# EAGLE schematic Rocekt_test_stand_input (EAGLE 9.2.0)
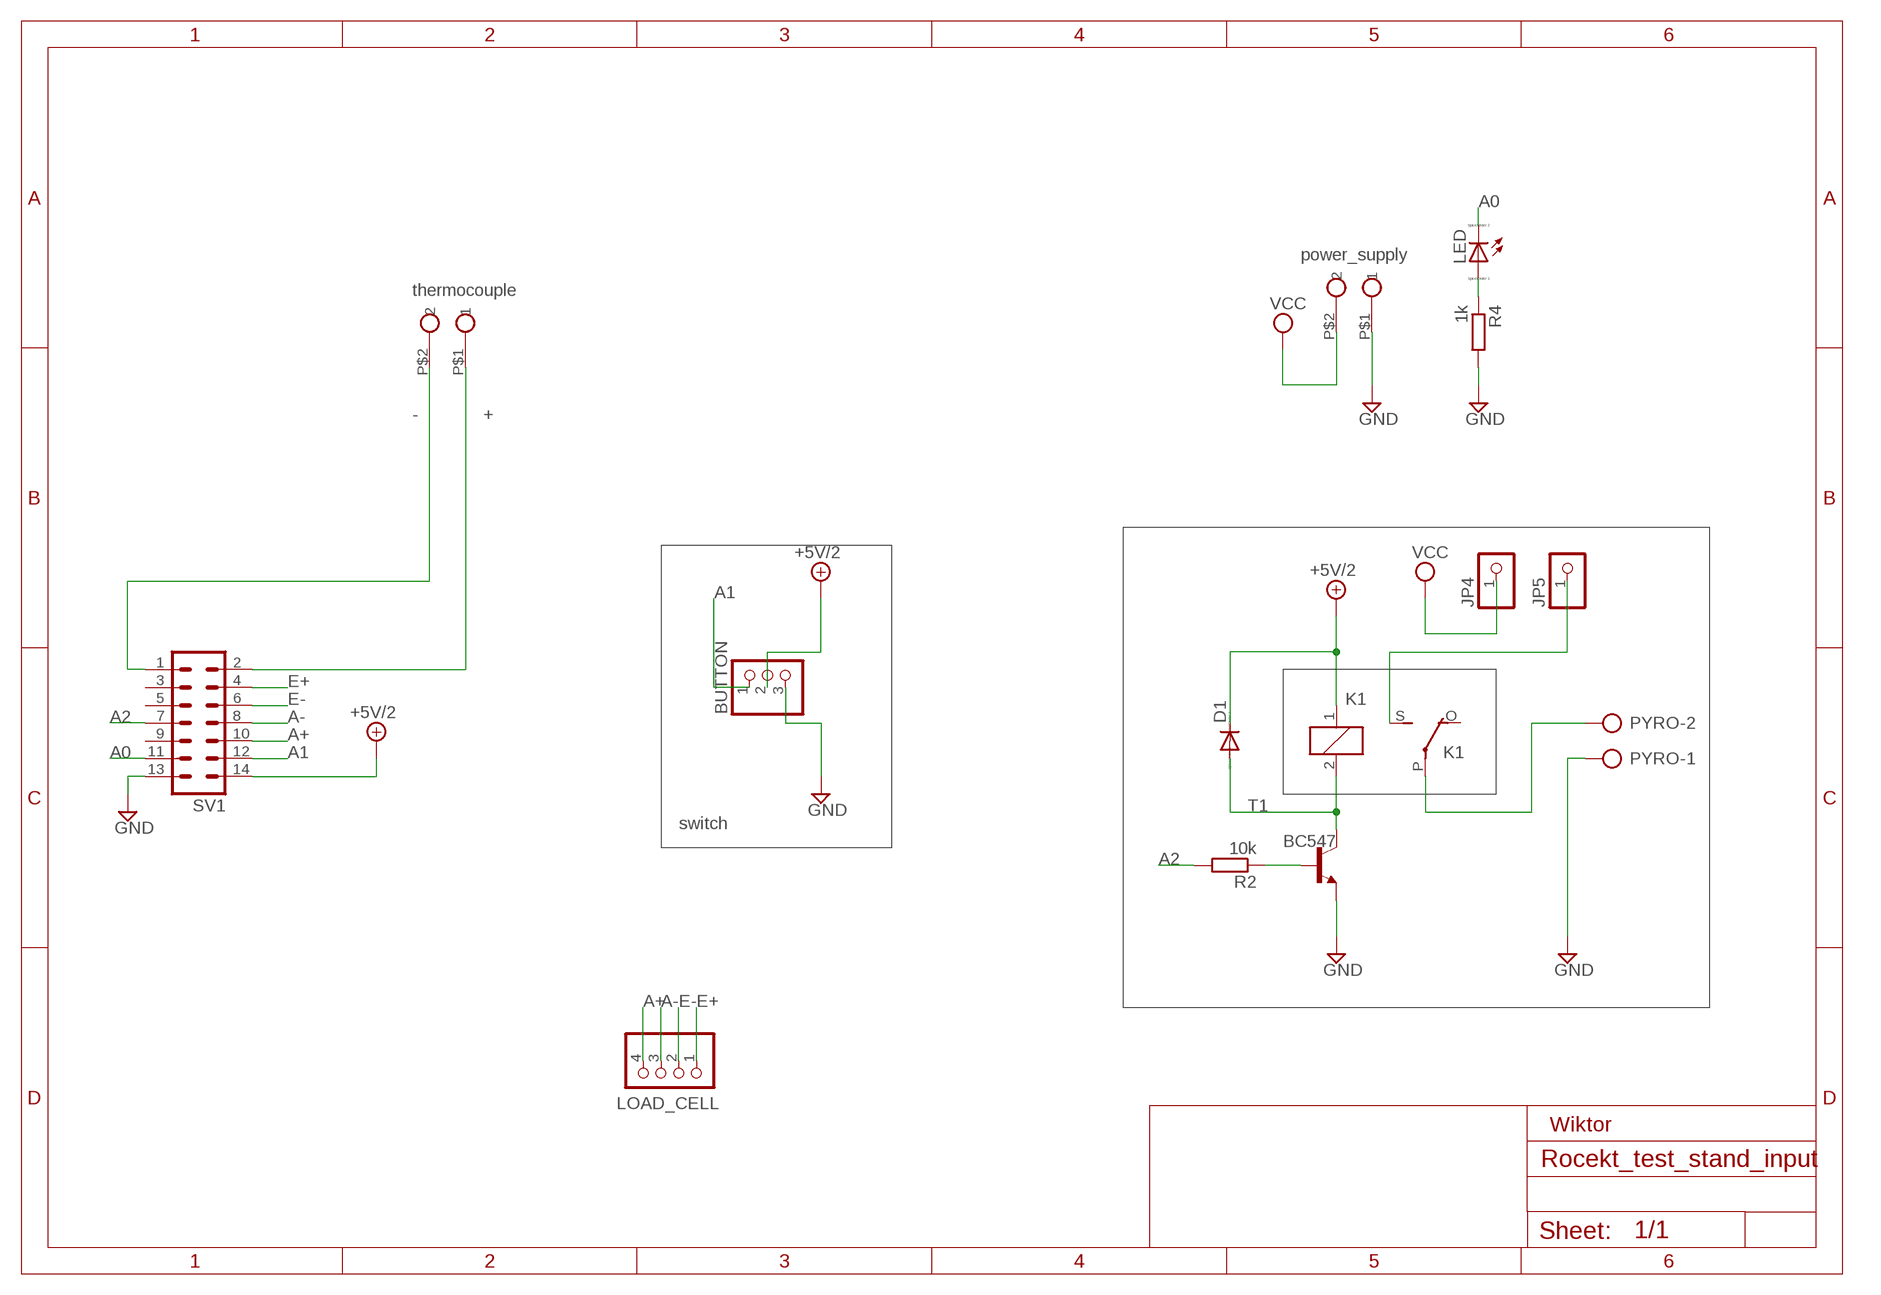
[diagram p0: schematic, sheet 1]

## Parts
BUTTON  PINHD-1X3/90  [1X03/90]
D1  1N4004  [DO41-10]
JP4  PINHD-1X1  [1X01]
JP5  PINHD-1X1  [1X01]
K1  G5L  [G5LE]
LED  LED_ELD260  [LED_LD260]
LOAD_CELL  PINHD-1X4  [1X04]
POWER_SUPPLY  ARK_8.5MM  [ZLACZESRUBOWE8.5MM]
PYRO  AK500/2  [AK500/2]
R2  10k  R-EU_0204/5  [0204/5]
R4  1k  R-EU_0204/5  [0204/5]
SV1  ML14  [ML14]
T1  BC547  [TO92]
U$1  ARK_8.5MM  [ZLACZESRUBOWE8.5MM]

## Nets
+: SV1.2 U$1.P$1
+5V/2: BUTTON.2 D1.C K1.1 SV1.14
-: SV1.1 U$1.P$2
A0: LED.K(C) SV1.11
A1: BUTTON.1 SV1.12
A2: R2.2 SV1.7
A+: LOAD_CELL.4 SV1.10
A-: LOAD_CELL.3 SV1.8
E+: LOAD_CELL.1 SV1.4
E-: LOAD_CELL.2 SV1.6
GND: BUTTON.3 POWER_SUPPLY.P$1 PYRO.1 R4.2 SV1.13 T1.1(E)
N$1: D1.A K1.2 T1.3(C)
N$2: R2.1 T1.2(B)
N$3: K1.P(2:P) PYRO.2
N$6: LED.A R4.1
N$7: JP5.1 K1.S(2:S)
VCC: JP4.1 POWER_SUPPLY.P$2
Unconnected: K1.O(2:O) SV1.3 SV1.5 SV1.9

## Notes on the sheet
- power_supply
- thermocouple
- switch
- Wiktor

## Library data of the parts
BUTTON = pinhead:PINHD-1X3: PIN HEADER
D1 = diode:1N4004: DIODE general purpose rectifier, 1 A
JP4 JP5 = pinhead:PINHD-1X1: PIN HEADER
K1 = relay:G5L: RELAY 1 x switch, 10 A/120 V AC, 8 A/30 V ADC, Omron; OC_FARNELL: unknown; OC_NEWARK: unknown
LED = eagle-ltspice:LED_E: LED Source: http://www.osram.convergy.de Source: www.luxeon.com Source: www.kingbright.com; SPICEMODEL: NONE; SPICEPREFIX: D; SPICETYPE: diode
LOAD_CELL = pinhead:PINHD-1X4: PIN HEADER
POWER_SUPPLY U$1 = 111_ark_8.5mm:ARK_8.5MM
PYRO = con-ptr500:AK500/2: CONNECTOR; OC_FARNELL: unknown; OC_NEWARK: unknown
R2 R4 = rcl:R-EU_: RESISTOR, European symbol; SPICEPREFIX: R
SV1 = con-harting-ml:ML14: HARTING; OC_FARNELL: unknown; OC_NEWARK: unknown
T1 = transistor:BC547: NPN TRANSISTOR